# Altium schematic sheet smoothieboard-alt-p2.SchDoc: =ProjectTitle
size B; Organization: Altium Limited; Address1: L3, 12a Rodborough Rd; Address2: Frenchs Forest; Address3: NSW; Address4: Australia 2086; DocumentNumber: 3; Revision: 0.1; SheetNumber: 3; SheetTotal: 6
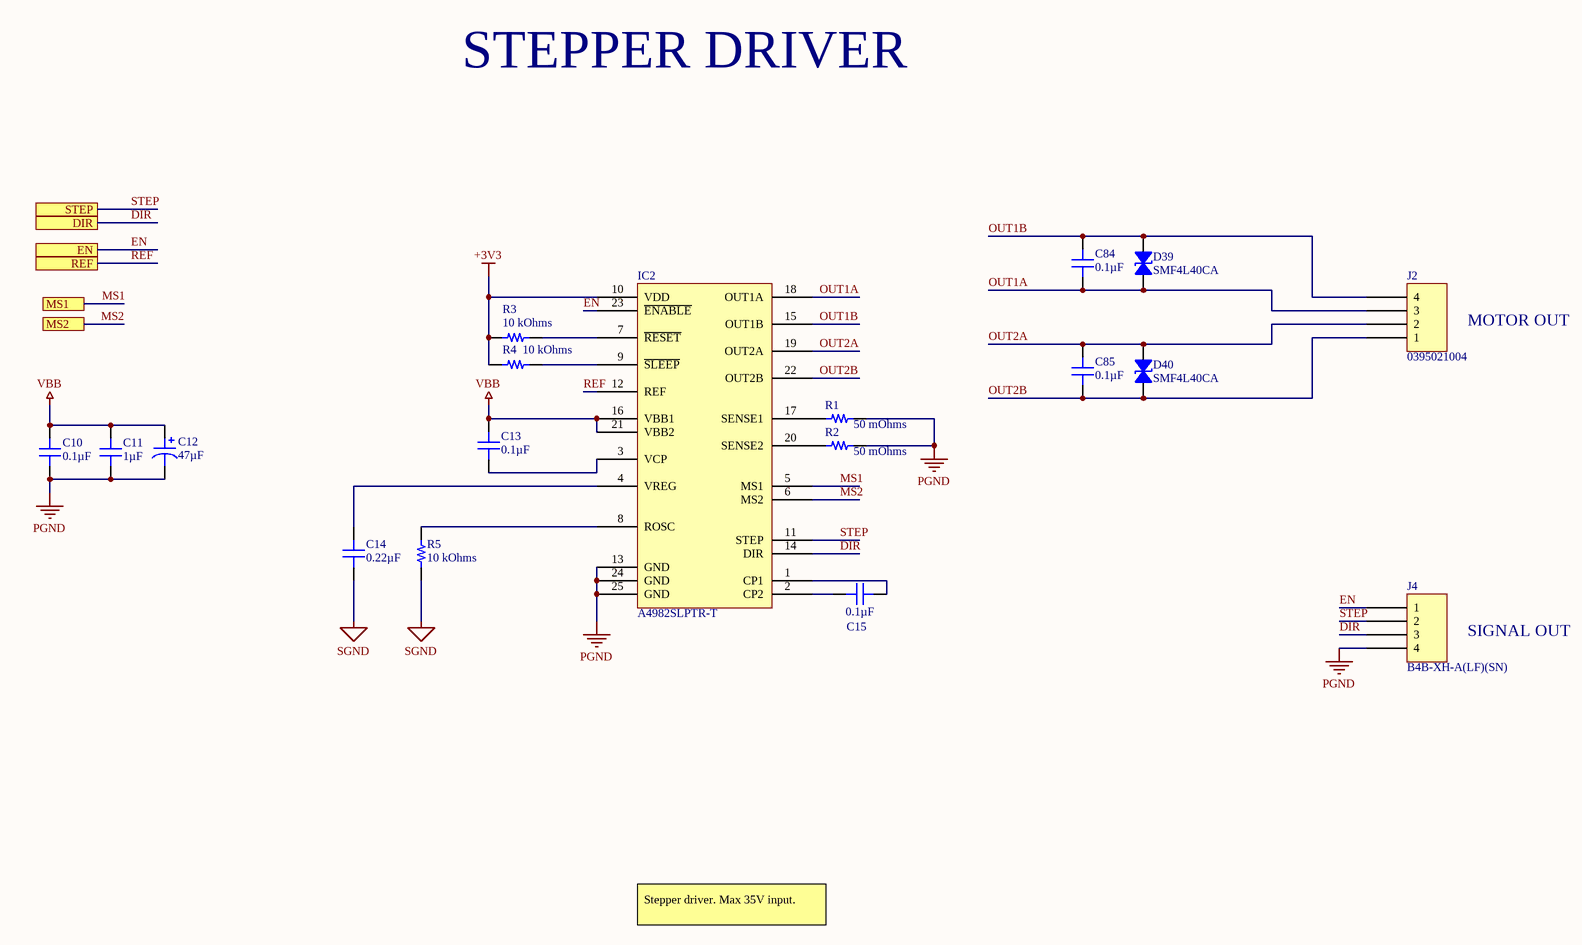
[diagram p0: smoothieboard-alt-p2.SchDoc]

## Parts
C10  0.1µF  [CAP 0603_1608]
C11  1µF  [CAP 0603_1608]
C12  47µF  [CAP ALSMD 8.3MM H10.5MM]
C13  0.1µF  [CAP 0402_1005]
C14  0.22µF  [CAP 0603_1608]
C15  0.1µF  [CAP 0402_1005]
C84  0.1µF  [CAP 0402_1005]
C85  0.1µF  [CAP 0402_1005]
D39  SMF4L40CA  [SOD123F]
D40  SMF4L40CA  [SOD123F]
IC2  A4982SLPTR-T  [ALLEGRO TSSOP-24 LP]
J2  0395021004  [MOLEX 395021004]
J4  B4B-XH-A(LF)(SN)  [JST XH B4B-XH-A]
R1  50 mOhms  [RES 2512_6432]
R2  50 mOhms  [RES 2512_6432]
R3  10 kOhms  [RES 0402_1005]
R4  10 kOhms  [RES 0402_1005]
R5  10 kOhms  [RES 0402_1005]

## Ports
DIR, EN, MS1, MS2, REF, STEP

## Nets
+3V3: IC2.10(VDD) R3.2 R4.2
PGND: C10.1 C11.1 C12.2 IC2.13(GND) IC2.24(GND) IC2.25(GND) J4.4 R1.2 R2.2
SGND: C14.1 R5.2
VBB: C10.2 C11.2 C12.1 C13.2 IC2.16(VBB1) IC2.21(VBB2)
DIR: IC2.14(DIR) J4.3 ; port DIR
EN: IC2.23(~{ENABLE}) J4.1 ; port EN
MS1: IC2.5(MS1) ; port MS1
MS2: IC2.6(MS2) ; port MS2
OUT1A: C84.1 D39.1 IC2.18(OUT1A) J2.3
OUT1B: C84.2 D39.2 IC2.15(OUT1B) J2.4
OUT2A: C85.2 D40.2 IC2.19(OUT2A) J2.2
OUT2B: C85.1 D40.1 IC2.22(OUT2B) J2.1
REF: IC2.12(REF) ; port REF
STEP: IC2.11(STEP) J4.2 ; port STEP
NetC13_1: C13.1 IC2.3(VCP)
NetC14_2: C14.2 IC2.4(VREG)
NetC15_1: C15.1 IC2.2(CP2)
NetC15_2: C15.2 IC2.1(CP1)
NetIC2_7: IC2.7(~{RESET}) R3.1
NetIC2_8: IC2.8(ROSC) R5.1
NetIC2_9: IC2.9(~{SLEEP}) R4.1
NetIC2_17: IC2.17(SENSE1) R1.1
NetIC2_20: IC2.20(SENSE2) R2.1

## Notes on the sheet
- STEPPER DRIVER
- MOTOR OUT
- SIGNAL OUT
- Stepper driver. Max 35V input.
- Title
- Size:
- Date:
- B
- Number:
- Time:
- Revision:
- Sheet
- of
- File:

## Library data of the parts
C10 = C0603C104K5RAC7411: CAP CER 0.1UF 50V X7R 0603; Manufacturer: KEMET; Tolerance: ±10%; Part Number: C0603C104K5RAC7411; Value: 0.1µF; Applications: Bypass, Decoupling; Capacitance: 0.1µF; ComponentLink1Description: Datasheet; ComponentLink1URL: https://api.kemet.com/component-edge/download/datasheet/C0603C104K5RAC7411.pdf; ComponentLink2Description: DigiKey Link; ComponentLink2URL: http://digikey.com/product-detail/en/kemet/C0603C104K5RAC7411/399-7374-2-ND/3317013; Device Package: 0603 (1608 Metric); LastUpdated: 9/2/2020 01:03:36; Lifecycle Status: Active; Minimum Order: 15000; Mounting Type: Surface Mount, MLCC; Operating Temperature: -55°C ~ 125°C; Package / Case: 0603 (1608 Metric); Packaging: TapeAndReel; PartId: 2233; Part Status: Active; Price: 0.02; Series: SMD Comm X7R; Size / Dimension: 0.063" L x 0.031" W (1.60mm x 0.80mm); Supplier 1: DigiKey; Supplier Part Number 1: 399-7374-2-ND; Temperature Coefficient: X7R; Thickness (Max): 0.035" (0.90mm); Voltage - Rated: 50V
C11 = UMK107ABJ105MAHT: CAP CER 1UF 50V X5R 0603; Manufacturer: Taiyo Yuden; Tolerance: ±20%; Part Number: UMK107ABJ105MAHT; Value: 1µF; Applications: Automotive, SMPS Filtering; Capacitance: 1µF; ComponentLink1Description: Datasheet; ComponentLink1URL: https://www.yuden.co.jp/productdata/catalog/mlcc_all_hq_e.pdf; ComponentLink2Description: DigiKey Link; ComponentLink2URL: http://digikey.com/product-detail/en/taiyo-yuden/UMK107ABJ105MAHT/587-4958-1-ND/6563801; Device Package: 0603 (1608 Metric); LastUpdated: 9/2/2020 01:03:34; Lifecycle Status: Active; Minimum Order: 1; Mounting Type: Surface Mount, MLCC; Operating Temperature: -55°C ~ 85°C; Package / Case: 0603 (1608 Metric); Packaging: TapeAndReel; PartId: 3194; Part Status: Active; Price: 0.04; Ratings: AEC-Q200; Series: M; Size / Dimension: 0.063" L x 0.031" W (1.60mm x 0.80mm); Supplier 1: DigiKey; Supplier Part Number 1: 587-4958-1-ND; Temperature Coefficient: X5R; Thickness (Max): 0.037" (0.95mm); Voltage - Rated: 50V
C12 = 63SEV47M8X10.5: CAP ALUM 47UF 20% 63V SMD; Manufacturer: Rubycon; Lifetime @ Temp.: 2000 Hrs @ 85°C; Polarization: Polar; Ripple Current @ High Frequency: 255mA @ 10kHz; Ripple Current @ Low Frequency: 170mA @ 120Hz; Surface Mount Land Size: 0.327" L x 0.327" W (8.30mm x 8.30mm); Part Number: 63SEV47M8X10.5; Applications: Automotive; Capacitance: 47µF; ComponentLink1Description: Datasheet; ComponentLink1URL: http://www.rubycon.co.jp/en/catalog/e_pdfs/aluminum/e_sev.pdf; ComponentLink2Description: DigiKey Link; ComponentLink2URL: http://digikey.com/product-detail/en/rubycon/63SEV47M8X10.5/1189-2502-1-ND/4842406; Device Package: Radial, Can - SMD; Height - Seated (Max): 0.413" (10.50mm); LastUpdated: 9/2/2020 01:25:13; Lifecycle Status: Active; Minimum Order: 1; Mounting Type: Surface Mount; Operating Temperature: -40°C ~ 85°C; Package / Case: Radial, Can - SMD; Packaging: TapeAndReel; PartId: 7768; Part Status: Active; Price: 0.26; Ratings: AEC-Q200; Series: SEV; Size / Dimension: 0.315" Dia (8.00mm); Supplier 1: DigiKey; Supplier Part Number 1: 1189-2502-1-ND; Tolerance: ±20%; Value: 47µF; Voltage - Rated: 63V
C13 C15 C84 C85 = CGA2B3X5R1V104K050BB: CAP CER 0.1UF 35V X5R 0402; Manufacturer: TDK Corporation; Tolerance: ±10%; Part Number: CGA2B3X5R1V104K050BB; Value: 0.1µF; Applications: Automotive; Capacitance: 0.1µF; ComponentLink1Description: Datasheet; ComponentLink1URL: https://product.tdk.com/info/en/catalog/datasheets/mlcc_automotive_general_en.pdf?ref_disty=digikey; ComponentLink2Description: DigiKey Link; ComponentLink2URL: http://digikey.com/product-detail/en/tdk-corporation/CGA2B3X5R1V104K050BB/445-12199-1-ND/3953865; Device Package: 0402 (1005 Metric); LastUpdated: 9/2/2020 01:01:59; Lifecycle Status: Active; Minimum Order: 1; Mounting Type: Surface Mount, MLCC; Operating Temperature: -55°C ~ 85°C; Package / Case: 0402 (1005 Metric); Packaging: TapeAndReel; PartId: 11879; Part Status: Active; Price: 0.02; Ratings: AEC-Q200; Series: CGA; Size / Dimension: 0.039" L x 0.020" W (1.00mm x 0.50mm); Supplier 1: DigiKey; Supplier Part Number 1: 445-12199-1-ND; Temperature Coefficient: X5R; Thickness (Max): 0.022" (0.55mm); Voltage - Rated: 35V
C14 = CC0603MRX7R6BB224: CAP CER 0.22UF 10V X7R 0603; Manufacturer: Yageo; Tolerance: ±20%; Part Number: CC0603MRX7R6BB224; Value: 0.22µF; Applications: General Purpose; Capacitance: 0.22µF; ComponentLink1Description: Datasheet; ComponentLink1URL: https://www.yageo.com/upload/media/product/productsearch/datasheet/mlcc/UPY-GPHC_X7R_6.3V-to-50V_18.pdf; ComponentLink2Description: DigiKey Link; ComponentLink2URL: http://digikey.com/product-detail/en/yageo/CC0603MRX7R6BB224/311-4106-1-ND/8025195; Device Package: 0603 (1608 Metric); LastUpdated: 9/2/2020 01:03:36; Lifecycle Status: Active; Minimum Order: 1; Mounting Type: Surface Mount, MLCC; Operating Temperature: -55°C ~ 125°C; Package / Case: 0603 (1608 Metric); Packaging: TapeAndReel; PartId: 2295; Part Status: Active; Price: 0.02; Series: CC; Size / Dimension: 0.063" L x 0.031" W (1.60mm x 0.80mm); Supplier 1: DigiKey; Supplier Part Number 1: 311-4106-1-ND; Temperature Coefficient: X7R; Thickness (Max): 0.035" (0.90mm); Voltage - Rated: 10V
D39 D40 = SMF4L40CA: TVS DIODE SMF4L 40V BI 400W; Manufacturer: Littelfuse Inc.; Bidirectional Channels: 1; Current - Peak Pulse (10/1000µs): 6.2A; Power Line Protection: No; Type: Zener; Voltage - Breakdown (Min): 44.4V; Voltage - Clamping (Max) @ Ipp: 64.5V; Part Number: SMF4L40CA; Applications: General Purpose; ComponentLink1Description: Datasheet; ComponentLink1URL: https://www.littelfuse.com/~/media/electronics/datasheets/tvs_diodes/littelfuse_tvs_diode_smf4l_datasheet.pdf.pdf; ComponentLink2Description: DigiKey Link; ComponentLink2URL: http://digikey.com/product-detail/en/littelfuse-inc/SMF4L40CA/18-SMF4L40CACT-ND/10710302; LastUpdated: 9/2/2020 01:28:38; Lifecycle Status: Active; Minimum Order: 1; Mounting Type: Surface Mount; Operating Temperature: -55°C ~ 150°C (TJ); Package / Case: SOD-123F; Packaging: Unknown; PartId: 10236; Part Status: Active; Power - Peak Pulse: 400W; Price: 0.12; Series: SMF4L; Supplier 1: DigiKey; Supplier Part Number 1: 18-SMF4L40CACT-ND; Supplier Device Package: SOD-123FL; Voltage - Reverse Standoff (Typ): 40V
IC2 = A4982SLPTR-T: IC MTR DRV BIPOLR 3-5.5V 24TSSOP; Manufacturer: Allegro MicroSystems; Current - Output: 2A; Function: Driver - Fully Integrated, Control and Power Stage; Interface: Logic; Motor Type - Stepper: Bipolar; Output Configuration: Half Bridge (4); Step Resolution: 1, 1/2, 1/4, 1/16; Voltage - Load: 8V ~ 35V; Voltage - Supply: 3V ~ 5.5V; Part Number: A4982SLPTR-T; Applications: General Purpose; ComponentLink1Description: Datasheet; ComponentLink1URL: https://www.allegromicro.com/~/media/Files/Datasheets/A4982-Datasheet.ashx; ComponentLink2Description: DigiKey Link; ComponentLink2URL: //digikey.com/product-detail/en/allegro-microsystems/A4982SLPTR-T/620-1352-2-ND/2295512; Device Package: 24-TSSOP (0.173", 4.40mm Width) Exposed Pad; LastUpdated: 12/12/2019 08:08:45; Lifecycle Status: 0; Minimum Order: 1; Mounting Type: Surface Mount; Operating Temperature: -20°C ~ 150°C (TJ); Package / Case: 24-TSSOP (0.173", 4.40mm Width) Exposed Pad; Packaging: TapeAndReel; PartId: 10; Part Status: Active; Price: 1.69; Series: -; Supplier 1: DigiKey; Supplier Part Number 1: 620-1352-2-ND; Supplier Device Package: 24-TSSOP-EP; Technology: DMOS
J2 = 0395021004: TERM BLOCK HDR 4POS 90DEG 3.5MM; Manufacturer: Molex; Current - UL: 8A; Header Orientation: 90°, Right Angle; Number of Levels: 1; Number of Positions: 4; Pitch: 0.138" (3.50mm); Voltage - UL: 300V; Part Number: 0395021004; Color: Black; ComponentLink1Description: Datasheet; ComponentLink1URL: https://www.molex.com/pdm_docs/sd/395021002_sd.pdf; ComponentLink2Description: DigiKey Link; ComponentLink2URL: http://digikey.com/product-detail/en/molex/0395021004/WM7772-ND/1280623; Contact Mating Finish: Tin; LastUpdated: 6/25/2020 15:44:36; Lifecycle Status: Active; Minimum Order: 1; Mounting Type: Through Hole; Operating Temperature: -40°C ~ 105°C; Packaging: Tray; Part Status: Active; Positions Per Level: 4; Price: 1.07; Series: Eurostyle ESE 39502; Supplier 1: DigiKey; Supplier Part Number 1: WM7772-ND; Termination Style: Solder; Type: Header, Male Pins, Shrouded (4 Side)
J4 = B4B-XH-A(LF)(SN): CONN HEADER VERT 4POS 2.5MM; Manufacturer: JST Sales America Inc.; Contact Length - Post: 0.134" (3.40mm); Current Rating (Amps): 3A; Material Flammability Rating: UL94 V-0; Number of Positions: 4; Number of Positions Loaded: All; Pitch - Mating: 0.098" (2.50mm); Shrouding: Shrouded - 4 Wall; Style: Board to Cable/Wire; Voltage Rating: 250V; Part Number: B4B-XH-A(LF)(SN); ComponentLink1Description: Datasheet; ComponentLink1URL: http://www.jst-mfg.com/product/pdf/eng/eXH.pdf; ComponentLink2Description: DigiKey Link; ComponentLink2URL: http://digikey.com/product-detail/en/jst-sales-america-inc/B4B-XH-A-LF-SN/455-2249-ND/1651047; Connector Type: Header; Contact Finish - Mating: Tin; Contact Finish - Post: Tin; Contact Material: Brass; Contact Shape: Square; Contact Type: Male Pin; Fastening Type: Detent Lock; Insulation Color: Natural; Insulation Height: 0.276" (7.00mm); Insulation Material: Polyamide (PA66), Nylon 6/6; LastUpdated: 1/12/2020 23:46:34; Lifecycle Status: Active; Minimum Order: 1; Mounting Type: Through Hole; Number of Rows: 1; Operating Temperature: -25°C ~ 85°C; Packaging: Bulk; PartId: 69; Part Status: Active; Price: 0.21; Series: XH; Supplier 1: DigiKey; Supplier Part Number 1: 455-2249-ND; Termination: Press-Fit, Solder
R1 R2 = Y14870R05000B9W: RES 0.05 OHM 0.1% 1W 2512; Manufacturer: Vishay Foil Resistors (Division of Vishay Precision Group); Temperature Coefficient: ±15ppm/°C; Part Number: Y14870R05000B9W; ComponentLink1Description: Datasheet; ComponentLink1URL: http://www.vishaypg.com/docs/63089/csm.pdf; ComponentLink2Description: DigiKey Link; ComponentLink2URL: http://digikey.com/product-detail/en/vishay-foil-resistors-division-of-vishay-precision-group/Y14870R05000B9W/Y1487-.05-ND/1888125; Composition: Metal Foil; Device Package: 2512 (6432 Metric); Features: Current Sense, Moisture Resistant; Height - Seated (Max): 0.035" (0.89mm); LastUpdated: 9/2/2020 01:27:03; Lifecycle Status: Active; Minimum Order: 1; Number of Terminations: 4; Operating Temperature: -65°C ~ 170°C; Package / Case: 2512 (6432 Metric); Packaging: Tray; Part Status: Active; Power (Watts): 1W; Price: 13.63; Resistance: 50 mOhms; Series: CSM; Size / Dimension: 0.250" L x 0.125" W (6.35mm x 3.18mm); Supplier 1: DigiKey; Supplier Part Number 1: Y1487-.05-ND; Tolerance: ±0.1%; Value: 50 mOhms
R3-R5 = CRCW040210K0JNTD: RES SMD 10K OHM 5% 1/16W 0402; Manufacturer: Vishay Dale; Power (Watts): 0.063W, 1/16W; Temperature Coefficient: ±200ppm/°C; Part Number: CRCW040210K0JNTD; Value: 10 kOhms; ComponentLink1Description: Datasheet; ComponentLink1URL: http://www.vishay.com/docs/20008/dcrcw.pdf; ComponentLink2Description: DigiKey Link; ComponentLink2URL: http://digikey.com/product-detail/en/vishay-dale/CRCW040210K0JNTD/541-CRCW040210K0JNTDCT-ND/11501263; Composition: Thick Film; Device Package: 0402 (1005 Metric); Features: Automotive AEC-Q200; LastUpdated: 9/2/2020 01:07:22; Lifecycle Status: Active; Minimum Order: 1; Number of Terminations: 2; Operating Temperature: -55°C ~ 155°C; Package / Case: 0402 (1005 Metric); Packaging: TapeAndReel; PartId: 56880; Price: 0.01; Ratings: AEC-Q200; Resistance: 10 kOhms; Series: CRCW; Supplier 1: DigiKey; Supplier Part Number 1: 541-CRCW040210K0JNTDCT-ND; Supplier Device Package: 0402; Tolerance: ±5%